# EAGLE design routerboard (EAGLE 5.10)
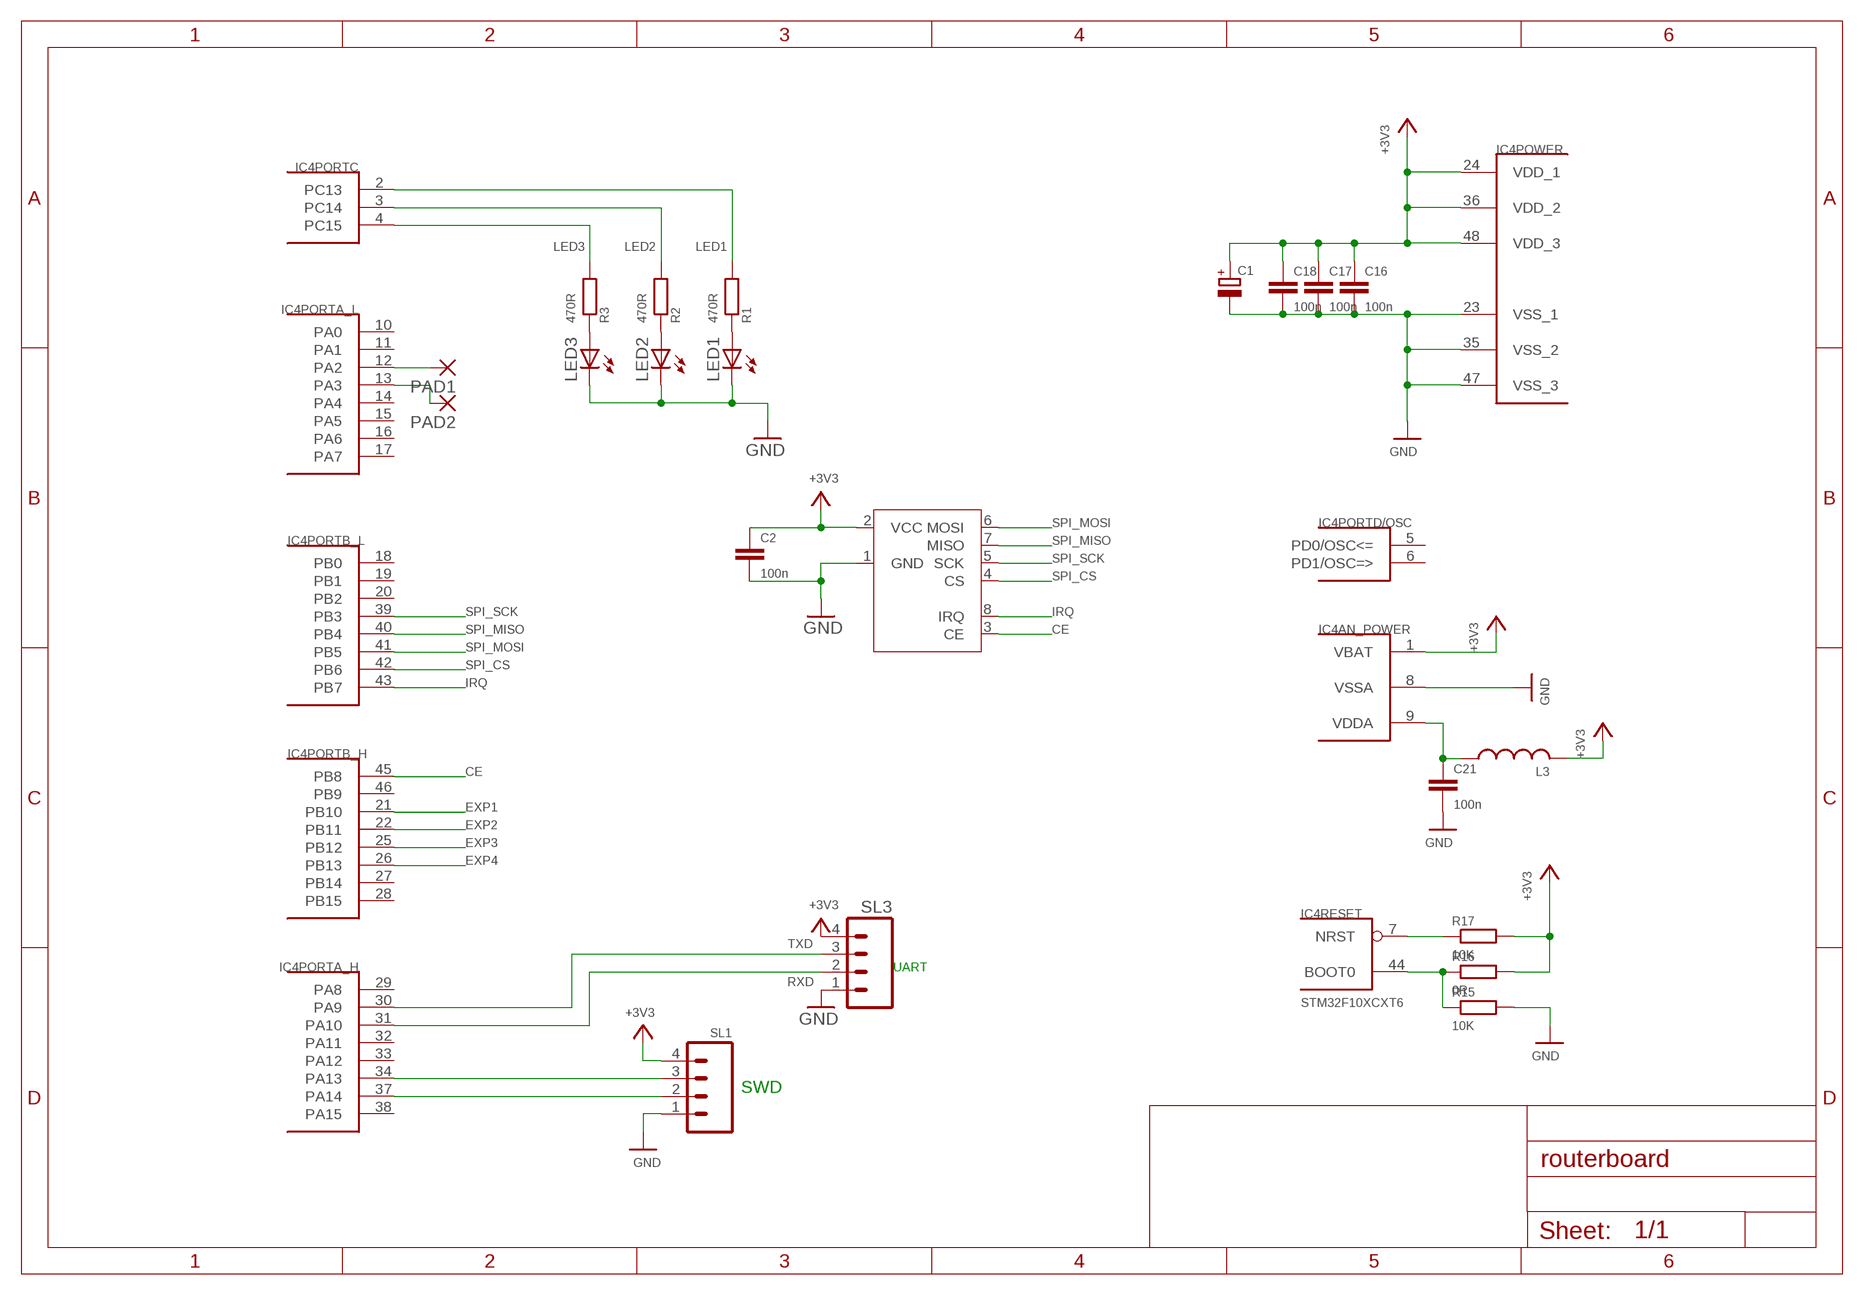
[diagram p0: schematic, sheet 1]

## Parts
C1  CPOL-EUE2.5-6  [E2,5-6]
C2  100n  C-EUC1206  [C1206]
C16  100n  C-EUC1206  [C1206]
C17  100n  C-EUC1206  [C1206]
C18  100n  C-EUC1206  [C1206]
C21  100n  C-EUC1206  [C1206]
IC1  NRF24L01  [NRF24L01]
IC4  STM32F10XCXT6  [TQFP48]
L3  L-USL2825P  [L2825P]
LED1  LEDCHIP-LED0805  [CHIP-LED0805]
LED2  LEDCHIP-LED0805  [CHIP-LED0805]
LED3  LEDCHIP-LED0805  [CHIP-LED0805]
PAD1  SMD2  [SMD1,27-2,54]
PAD2  SMD2  [SMD1,27-2,54]
R1  470R  R-EU_R0805  [R0805]
R2  470R  R-EU_R0805  [R0805]
R3  470R  R-EU_R0805  [R0805]
R15  10K  R-EU_R0805  [R0805]
R16  0R  R-EU_R0805  [R0805]
R17  10K  R-EU_R0805  [R0805]
SL1  M04  [04P]
SL3  M04  [04P]

## Nets
+3V3: C1.+ C2.1 C16.1 C17.1 C18.1 IC1.2(VCC) IC4.1(AN_POWER:VBAT) IC4.24(POWER:VDD_1) IC4.36(POWER:VDD_2) IC4.48(POWER:VDD_3) L3.2 R16.2 R17.2 SL1.4 SL3.4
CE: IC1.3(CE) IC4.45(PORTB_H:PB8)
EXP1: IC4.21(PORTB_H:PB10)
EXP2: IC4.22(PORTB_H:PB11)
EXP3: IC4.25(PORTB_H:PB12)
EXP4: IC4.26(PORTB_H:PB13)
GND: C1.- C2.2 C16.2 C17.2 C18.2 C21.2 IC1.1(GND) IC4.8(AN_POWER:VSSA) IC4.23(POWER:VSS_1) IC4.35(POWER:VSS_2) IC4.47(POWER:VSS_3) LED1.C LED2.C LED3.C R15.2 SL1.1 SL3.1
IRQ: IC1.8(IRQ) IC4.43(PORTB_L:PB7)
LED1: IC4.2(PORTC:PC13) R1.2
LED2: IC4.3(PORTC:PC14) R2.2
LED3: IC4.4(PORTC:PC15) R3.2
N$1: IC4.12(PORTA_L:PA2) PAD1.1(P)
N$2: IC4.13(PORTA_L:PA3) PAD2.1(P)
N$5: LED1.A R1.1
N$6: LED2.A R2.1
N$7: LED3.A R3.1
N$13: IC4.44(RESET:BOOT0) R15.1 R16.1
N$15: C21.1 IC4.9(AN_POWER:VDDA) L3.1
NRST: IC4.7(RESET:NRST) R17.1
RXD: IC4.31(PORTA_H:PA10) SL3.2
SPI_CS: IC1.4(CS) IC4.42(PORTB_L:PB6)
SPI_MISO: IC1.7(MISO) IC4.40(PORTB_L:PB4)
SPI_MOSI: IC1.6(MOSI) IC4.41(PORTB_L:PB5)
SPI_SCK: IC1.5(SCK) IC4.39(PORTB_L:PB3)
SWDCLK: IC4.37(PORTA_H:PA14) SL1.2
SWDIO: IC4.34(PORTA_H:PA13) SL1.3
TXD: IC4.30(PORTA_H:PA9) SL3.3
Unconnected: IC4.5(PORTD/OSC:PD0/OSC<=) IC4.6(PORTD/OSC:PD1/OSC=>) IC4.10(PORTA_L:PA0) IC4.11(PORTA_L:PA1) IC4.14(PORTA_L:PA4) IC4.15(PORTA_L:PA5) IC4.16(PORTA_L:PA6) IC4.17(PORTA_L:PA7) IC4.18(PORTB_L:PB0) IC4.19(PORTB_L:PB1) IC4.20(PORTB_L:PB2) IC4.27(PORTB_H:PB14) IC4.28(PORTB_H:PB15) IC4.29(PORTA_H:PA8) IC4.32(PORTA_H:PA11) IC4.33(PORTA_H:PA12) IC4.38(PORTA_H:PA15) IC4.46(PORTB_H:PB9)

## Notes on the sheet
- UART
- SWD

## Library data of the parts
C1 = rcl:CPOL-EU: POLARIZED CAPACITOR, European symbol
C2 C16-C18 C21 = rcl:C-EU: CAPACITOR, European symbol
IC1 = Kuba:NRF24L01
IC4 = stm32:STM32F10XCXT6: ST STM32F101/103 48pin LQFP
L3 = rcl:L-US: INDUCTOR, American symbol
LED1-LED3 = led:LED: LED OSRAM: - CHIPLED LG R971, LG N971, LY N971, LG Q971, LY Q971, LO R971, LY R971 LH N974, LH R974 LS Q976, LO Q976, LY Q976 LO Q996 - Hyper CHIPLED LW Q18S LB Q993, LB Q99A, LB R99A - SideLED LS A670, LO A670, LY A670, LG A670, LP A670 LB A673, LV A673, LT A673, LW A673 LH A674 LY A675 LS A676, LA A676, LO A676, LY A676, LW A676 LS A679, LY A679, LG A679 - Hyper Micro SIDELED® LS Y876, LA Y876, LO Y876, LY Y876 LT Y87S - SmartLED LW L88C, LW L88S LB L89C, LB L89S, LG L890 LS L89K, LO L89K, LY L89K LS L896, LA L896, LO L896, LY L896 - TOPLED LS T670, LO T670, LY T670, LG T670, LP T670 LSG T670, LSP T670, LSY T670, LOP T670, LYG T670 LG T671, LOG T671, LSG T671 LB T673, LV T673, LT T673, LW T673 LH T674 LS T676, LA T676, LO T676, LY T676, LB T676, LH T676, LSB T676, LW T676 LB T67C, LV T67C, LT T67C, LS T67K, LO T67K, LY T67K, LW E67C LS E67B, LA E67B, LO E67B, LY E67B, LB E67C, LV E67C, LT E67C LW T67C LS T679, LY T679, LG T679 LS T770, LO T770, LY T770, LG T770, LP T770 LB T773, LV T773, LT T773, LW T773 LH T774 LS E675, LA E675, LY E675, LS T675 LS T776, LA T776, LO T776, LY T776, LB T776 LHGB T686 LT T68C, LB T68C - Hyper Mini TOPLED® LB M676 - Mini TOPLED Santana® LG M470 LS M47K, LO M47K, LY M47K Source: http://www.osram.convergy.de LUXEON: - LUMILED® LXK2-PW12-R00, LXK2-PW12-S00, LXK2-PW14-U00, LXK2-PW14-V00 LXK2-PM12-R00, LXK2-PM12-S00, LXK2-PM14-U00 LXK2-PE12-Q00, LXK2-PE12-R00, LXK2-PE12-S00, LXK2-PE14-T00, LXK2-PE14-U00 LXK2-PB12-K00, LXK2-PB12-L00, LXK2-PB12-M00, LXK2-PB14-N00, LXK2-PB14-P00, LXK2-PB14-Q00 LXK2-PR12-L00, LXK2-PR12-M00, LXK2-PR14-Q00, LXK2-PR14-R00 LXK2-PD12-Q00, LXK2-PD12-R00, LXK2-PD12-S00 LXK2-PH12-R00, LXK2-PH12-S00 LXK2-PL12-P00, LXK2-PL12-Q00, LXK2-PL12-R00 Source: www.luxeon.com KINGBRIGHT: KA-3528ASYC Source: www.kingbright.com
PAD1 PAD2 = wirepad:SMD2: SMD PAD
R1-R3 R15-R17 = rcl:R-EU_: RESISTOR, European symbol
SL1 SL3 = con-amp-quick:M04: AMP QUICK CONNECTOR

## Board
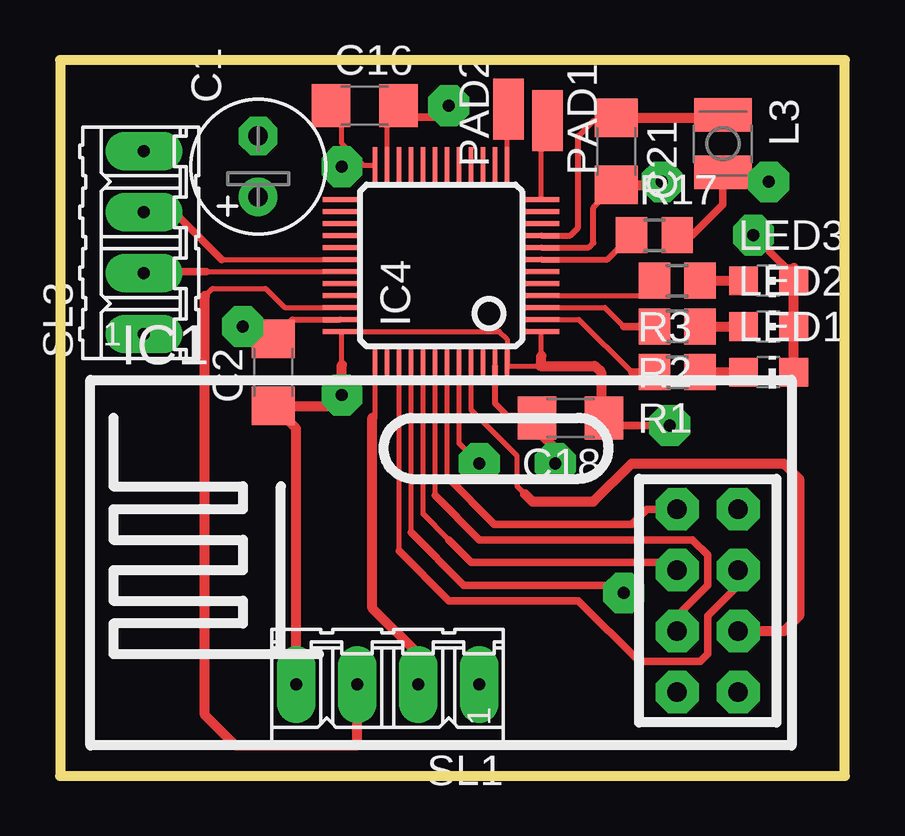
[diagram p1: board, top side]
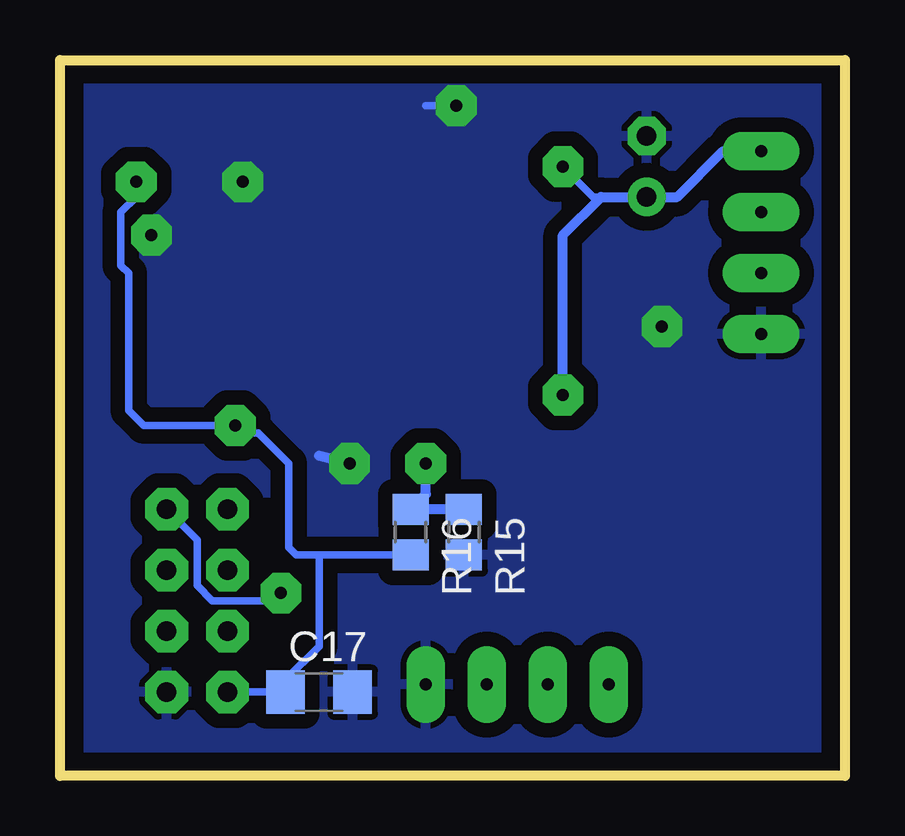
[diagram p2: board, bottom side, seen from below]

Size 32.7 x 29.84 mm. Coordinates in mm from the lower left corner, seen from the top.
Outline: 0,0 32.7,0 32.7,29.84 0,29.84 0,0
Copper layers (1*16): Top 0.035mm / dielectric 1.5mm / Bottom 0.035mm
Design rules "default *": minimum track width 0.2mm, minimum drill 1mil, track to track 8mil, track to pad 8mil, pad to pad 8mil, via to via 8mil, smd to smd 0mil, copper to edge 30mil, drill to drill 8mil, minimum pad ring 10mil, minimum via ring 8mil, stop-mask expansion 4mil, vias tented up to drill 0mil, thermal gap 10mil

### Footprints (pad centres in the part's own frame; a part is rotated, then mirrored left to right if it is on the bottom)
E2,5-6 = drill 0.813 pad 1.6 round: + -1.27,0 | drill 0.813 pad 1.6 octagon: - 1.27,0
C1206 = smd 1.6 x 1.8: 1 -1.4,0; 2 1.4,0
NRF24L01 = drill 0.813 pad 1.778 octagon: 1 0,0; 2 -2.54,0; 3 0,2.54; 4 -2.54,2.54; 5 0,5.08; 6 -2.54,5.08; 7 0,7.62; 8 -2.54,7.62
TQFP48 = smd 0.2 x 1.5: 1 -2.75,-4.183; 2 -2.25,-4.183; 3 -1.75,-4.183; 4 -1.25,-4.183; 5 -0.75,-4.183; 6 -0.25,-4.183; 7 0.25,-4.183; 8 0.75,-4.183; 9 1.25,-4.183; 10 1.75,-4.183; 11 2.25,-4.183; 12 2.75,-4.183; 25 2.75,4.183; 26 2.25,4.183; 27 1.75,4.183; 28 1.25,4.183; 29 0.75,4.183; 30 0.25,4.183; 31 -0.25,4.183; 32 -0.75,4.183; 33 -1.25,4.183; 34 -1.75,4.183; 35 -2.25,4.183; 36 -2.75,4.183 | smd 1.5 x 0.2: 13 4.183,-2.75; 14 4.183,-2.25; 15 4.183,-1.75; 16 4.183,-1.25; 17 4.183,-0.75; 18 4.183,-0.25; 19 4.183,0.25; 20 4.183,0.75; 21 4.183,1.25; 22 4.183,1.75; 23 4.183,2.25; 24 4.183,2.75; 37 -4.183,2.75; 38 -4.183,2.25; 39 -4.183,1.75; 40 -4.183,1.25; 41 -4.183,0.75; 42 -4.183,0.25; 43 -4.183,-0.25; 44 -4.183,-0.75; 45 -4.183,-1.25; 46 -4.183,-1.75; 47 -4.183,-2.25; 48 -4.183,-2.75
L2825P = smd 1.4 x 2.4: 1 -1.2,0; 2 1.2,0
CHIP-LED0805 = smd 1.2 x 1.2: A 0,-1.05; C 0,1.05
SMD1,27-2,54 = smd 1.27 x 2.54: 1 0,0
R0805 = smd 1.3 x 1.5: 1 -0.95,0; 2 0.95,0
04P = drill 0.5 pad 1.6 long: 1 -3.81,0; 2 -1.27,0; 3 1.27,0; 4 3.81,0

### Placement (x,y rotation side)
C1  8.25,25.4 90 top
C2  8.89,16.83 90 top
C16  12.7,27.94 0 top
C17  21.91,3.49 0 bottom
C18  21.27,14.92 180 top
C21  23.18,26.03 270 top
IC1  28.26,3.49 0 top
IC4  15.88,21.27 90 top
L3  27.62,26.35 270 top
LED1  29.53,16.83 270 top
LED2  29.53,18.73 270 top
LED3  29.53,20.64 270 top
PAD1  20.32,27.3 180 top
PAD2  18.69,27.78 0 top
R1  25.72,16.83 180 top
R2  25.72,18.73 180 top
R3  25.72,20.64 180 top
R15  15.88,10.16 270 bottom
R16  18.1,10.16 270 bottom
R17  24.77,22.54 0 top
SL1  13.65,3.81 180 top
SL3  3.49,22.23 90 top

### Tracks (layer width: path | path; a pad name or v marks a point on that pad's centre or on a via)
+3V3  (via drill 0.5 pad 1.7)
  Top 0.2: 20.06,17.52 IC4.1 | 20,17.09 IC4.48 18.63,18.2 18.31,18.52 IC4.36 11.75,18.47 11.75,17.14 | IC4.24 12.64,25.45 12.07,26.03 11.75,26.35 11.75,27.49 C16.1
  Top 0.305: C18.1 22.67,14.6 v25.4,14.6 | v29.53,24.77 28.01,24.77 L3.2 27.62,23.81 26.35,22.54 R17.2 | v11.75,25.4 11.75,25.72 12.07,26.03
  Top 0.406: C18.1 22.54,15.05 22.54,16.83 22.28,17.09 20,17.09 20.06,17.14 20.06,17.52 | SL1.4 9.84,14.48 C2.1 11.3,15.43 v11.75,15.88 11.75,17.14
  Bottom 0.305: IC1.2 C17.1 23.31,4 21.91,5.4 21.91,9.21 | R16.2 21.91,9.21 | 21.91,9.21 22.86,9.21 23.18,9.52 23.18,13.02 24.45,14.29 25.4,14.29 v25.4,14.6 29.21,14.6 29.85,15.24 29.85,20.95 30.16,21.27 30.16,23.49 29.53,24.13 v29.53,24.77 | 10.16,24.13 10.48,24.13 v11.75,25.4
  Bottom 0.406: SL3.4 5.08,26.03 6.99,24.13 C1.+ 10.16,24.13 11.75,22.54 v11.75,15.88
CE
  Top 0.2: IC4.45 17.13,15.26 19.05,13.34 19.05,12.06 19.37,11.75
  Top 0.406: IC1.3 30.16,6.03 30.8,6.67 30.8,12.38 30.16,13.02 23.81,13.02 22.22,11.43 19.68,11.43 19.37,11.75
GND  (via drill 0.5 pad 1.7)
  Top 0.2: IC4.23 13.63,27.46 C16.2
  Top 0.254: IC4.35 9.68,19.02 C2.2 | IC4.47 18.13,15.53 18.73,14.92 | IC4.8 22.02,22.02 22.22,22.23 22.22,23.68 C21.2
  Top 0.305: v28.89,22.54 30.26,21.17 30.58,21.17 | 13.63,27.46 15.72,27.46 v16.19,27.94
  Top 0.406: C21.2 24.95,24.63 v25.08,24.77 | LED1.C LED2.C LED3.C 30.58,21.17 | C2.2 8.13,18.23 v7.62,18.73 | 18.73,14.92 C18.2 19.87,14.42 20.64,13.65 v20.64,13.02
  Bottom 0.305: v16.19,27.94 17.46,27.94
  Bottom 0.406: v25.08,24.77 25.08,25.4 | v7.62,18.73 7.3,18.73 | v20.64,13.02 21.91,13.34
  pour Bottom (isolate 0.61): 0.64,0.63 32.07,0.63 32.07,33.34 0.32,33.34 0.32,0.63
IRQ
  Top 0.2: 16.13,12.45 IC4.43
  Top 0.305: 16.13,12.45 18.1,10.48 23.81,10.48 24.45,11.11 IC1.8
LED1
  Top 0.2: IC4.2 21.62,19.02 23.81,16.83
  Top 0.305: 23.81,16.83 R1.2
LED2
  Top 0.2: IC4.3 22.71,19.52 23.5,18.73
  Top 0.305: 23.5,18.73 R2.2
LED3
  Top 0.2: IC4.4 24.75,20.02 R3.2
N$1
  Top 0.2: IC4.12 20.06,27.68 PAD1.1
N$2
  Top 0.2: IC4.13 18.63,27.83 PAD2.1
N$5
  Top 0.406: R1.1 LED1.A
N$6
  Top 0.406: R2.1 LED2.A
N$7
  Top 0.406: R3.1 LED3.A
N$13  (via drill 0.5 pad 1.7)
  Top 0.2: IC4.44 16.63,13.85 v17.46,13.02
  Bottom 0.406: R15.1 R16.1 17.46,11.74 v17.46,13.02
N$15
  Top 0.254: IC4.9 21.25,22.52 21.59,22.86 21.59,26.67 22.22,27.3 23.05,27.3 C21.1
  Top 0.406: C21.1 27.5,27.43 L3.1
NRST
  Top 0.254: IC4.7 22.79,21.52 R17.1
RXD
  Top 0.2: 6.1,21.02 IC4.31
  Top 0.305: 6.1,21.02 3.56,21.02 SL3.2
SPI_CS
  Top 0.2: 15.63,11.68 IC4.42
  Top 0.305: 15.63,11.68 17.46,9.84 26.35,9.84 26.99,9.21 26.99,7.94 25.72,6.67 IC1.4
SPI_MISO  (via drill 0.5 pad 1.7)
  Top 0.2: 14.63,10.14 IC4.40
  Top 0.305: 14.63,10.14 16.83,7.94 23.18,7.94 v23.5,7.62
  Bottom 0.305: IC1.7 26.99,9.84 26.99,7.94 26.35,7.3 23.81,7.3 v23.5,7.62
SPI_MOSI
  Top 0.2: IC4.41 15.13,10.91 16.19,9.84
  Top 0.305: 16.19,9.84 17.14,8.89 25.4,8.89 IC1.6
SPI_SCK
  Top 0.2: 14.13,9.37 IC4.39
  Top 0.305: 14.13,9.37 16.19,7.3 21.59,7.3 24.13,4.76 26.67,4.76 26.99,5.08 26.99,6.67 28.26,7.94 IC1.5
SWDCLK
  Top 0.2: IC4.37 13.13,15.03 13.02,14.92
  Top 0.406: 13.02,14.92 13.02,6.98 14.92,5.08 SL1.2
SWDIO
  Top 0.2: IC4.34 9.37,19.52 8.57,20.32 6.35,20.32 6.03,20
  Top 0.406: 6.03,20 6.03,2.54 7.3,1.27 12.38,1.27 SL1.3
TXD
  Top 0.2: 6.74,21.52 IC4.30
  Top 0.305: 6.74,21.52 4.76,23.49 SL3.3

### Text on the board
koty: 29.8mm | 32.7mm